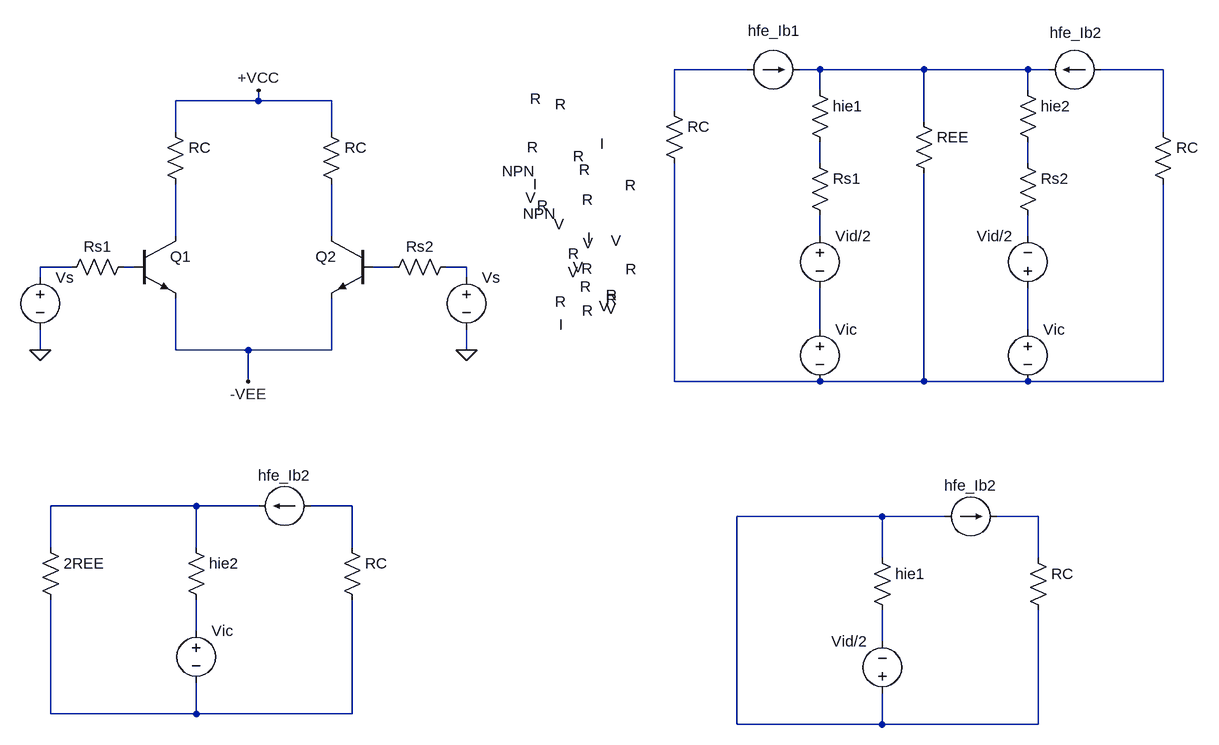
[diagram p0: schematic dibujos_primera_tanda.asc]
dibujos_primera_tanda.asc, the LTspice schematic file:
Version 4
SHEET 1 1276 824
WIRE 384 -256 272 -256
WIRE 496 -256 464 -256
WIRE 656 -256 496 -256
WIRE 816 -256 656 -256
WIRE 848 -256 816 -256
WIRE 1024 -256 928 -256
WIRE 496 -224 496 -256
WIRE 816 -224 816 -256
WIRE -368 -208 -368 -224
WIRE -368 -208 -496 -208
WIRE -256 -208 -368 -208
WIRE 272 -192 272 -256
WIRE 656 -176 656 -256
WIRE -496 -160 -496 -208
WIRE -256 -160 -256 -208
WIRE 1024 -160 1024 -256
WIRE 496 -112 496 -144
WIRE 816 -112 816 -144
WIRE -496 0 -496 -80
WIRE -256 0 -256 -80
WIRE 496 0 496 -32
WIRE 816 0 816 -32
WIRE -656 48 -704 48
WIRE -560 48 -576 48
WIRE -160 48 -192 48
WIRE -48 48 -80 48
WIRE -704 64 -704 48
WIRE -48 64 -48 48
WIRE 496 144 496 80
WIRE 816 144 816 80
WIRE -704 176 -704 144
WIRE -496 176 -496 96
WIRE -384 176 -496 176
WIRE -256 176 -256 96
WIRE -256 176 -384 176
WIRE -48 176 -48 144
WIRE -384 224 -384 176
WIRE 272 224 272 -112
WIRE 496 224 272 224
WIRE 656 224 656 -96
WIRE 656 224 496 224
WIRE 816 224 656 224
WIRE 1024 224 1024 -80
WIRE 1024 224 816 224
WIRE -464 416 -688 416
WIRE -368 416 -464 416
WIRE -224 416 -288 416
WIRE 592 432 368 432
WIRE 688 432 592 432
WIRE 832 432 768 432
WIRE -688 480 -688 416
WIRE -464 480 -464 416
WIRE -224 480 -224 416
WIRE 592 496 592 432
WIRE 832 496 832 432
WIRE -464 608 -464 560
WIRE 592 624 592 576
WIRE -688 736 -688 560
WIRE -464 736 -464 688
WIRE -464 736 -688 736
WIRE -224 736 -224 560
WIRE -224 736 -464 736
WIRE 368 752 368 432
WIRE 592 752 592 704
WIRE 592 752 368 752
WIRE 832 752 832 576
WIRE 832 752 592 752
FLAG -704 176 0
FLAG -48 176 0
FLAG -384 224 -VEE
FLAG -368 -224 +VCC
SYMBOL npn -560 0 R0
WINDOW 3 567 -100 Left 2
SYMATTR InstName Q1
SYMBOL npn -192 0 M0
WINDOW 3 -281 -34 Left 2
SYMATTR InstName Q2
SYMBOL res -512 -176 R0
WINDOW 3 562 -35 Left 2
SYMATTR InstName RC
SYMBOL res -272 -176 R0
WINDOW 3 360 -27 Left 2
SYMATTR InstName RC
SYMBOL res -560 32 R90
WINDOW 0 0 56 VBottom 2
WINDOW 3 -94 -629 VTop 2
SYMATTR InstName Rs1
SYMBOL res -64 32 R90
WINDOW 0 0 56 VBottom 2
WINDOW 3 -184 -118 VTop 2
SYMATTR InstName Rs2
SYMBOL voltage -48 48 R0
WINDOW 3 135 -66 Left 2
SYMATTR InstName Vs
SYMBOL voltage -704 48 R0
WINDOW 3 747 -107 Left 2
SYMATTR InstName Vs
SYMBOL res 256 -208 R0
WINDOW 3 -60 130 Left 2
SYMATTR InstName RC
SYMBOL current 384 -256 R270
WINDOW 0 44 42 VTop 2
WINDOW 3 -98 -223 VBottom 2
SYMATTR InstName hfe_Ib1
SYMBOL current 928 -256 R90
WINDOW 0 -41 38 VBottom 2
WINDOW 3 161 870 VTop 2
SYMATTR InstName hfe_Ib2
SYMBOL res 1008 -176 R0
WINDOW 3 -883 74 Left 2
SYMATTR InstName RC
SYMBOL res 480 -240 R0
WINDOW 3 -364 117 Left 2
SYMATTR InstName hie1
SYMBOL res 480 -128 R0
WINDOW 3 -350 72 Left 2
SYMATTR InstName Rs1
SYMBOL res 640 -192 R0
WINDOW 3 -513 270 Left 2
SYMATTR InstName REE
SYMBOL res 800 -240 R0
WINDOW 3 -603 291 Left 2
SYMATTR InstName hie2
SYMBOL res 800 -128 R0
WINDOW 3 -633 219 Left 2
SYMATTR InstName Rs2
SYMBOL voltage 496 -16 R0
WINDOW 3 -322 23 Left 2
SYMATTR InstName Vid/2
SYMBOL voltage 816 96 R180
WINDOW 0 24 96 Left 2
WINDOW 3 644 -12 Left 2
SYMATTR InstName Vid/2
SYMBOL voltage 496 128 R0
WINDOW 3 -365 -117 Left 2
SYMATTR InstName Vic
SYMBOL voltage 816 128 R0
WINDOW 3 -649 -16 Left 2
SYMATTR InstName Vic
SYMBOL res -704 464 R0
WINDOW 3 792 -363 Left 2
SYMATTR InstName 2REE
SYMBOL res -480 464 R0
WINDOW 3 610 -349 Left 2
SYMATTR InstName hie2
SYMBOL res -240 464 R0
WINDOW 3 407 -367 Left 2
SYMATTR InstName RC
SYMBOL current -288 416 R90
WINDOW 0 -32 40 VBottom 2
WINDOW 3 -429 -429 VTop 2
SYMATTR InstName hfe_Ib2
SYMBOL voltage -464 592 R0
WINDOW 3 580 -544 Left 2
SYMATTR InstName Vic
SYMBOL res 576 480 R0
WINDOW 3 -447 -430 Left 2
SYMATTR InstName hie1
SYMBOL res 816 480 R0
WINDOW 3 -708 -453 Left 2
SYMATTR InstName RC
SYMBOL current 688 432 R270
WINDOW 0 32 40 VTop 2
WINDOW 3 311 -590 VBottom 2
SYMATTR InstName hfe_Ib2
SYMBOL voltage 592 720 R180
WINDOW 0 24 96 Left 2
WINDOW 3 468 664 Left 2
SYMATTR InstName Vid/2

The netlist it stands for:
* dibujos_primera_tanda.asc
Q1 N006 N011 -VEE 0 NPN
Q2 N007 N012 -VEE 0 NPN
RC +VCC N006 R
RC +VCC N007 R
Rs1 N011 N010 R
Rs2 N013 N012 R
Vs N013 0 V
Vs N010 0 V
RC N001 N016 R
I§hfe_Ib1 N001 N002 I
I§hfe_Ib2 N003 N002 I
RC N003 N016 R
R§hie1 N002 N004 R
Rs1 N004 N008 R
REE N002 N016 R
R§hie2 N002 N005 R
Rs2 N005 N009 R
Vid/2 N008 N014 V
Vid/2 N015 N009 V
Vic N014 N016 V
Vic N015 N016 V
R§2REE N017 N023 R
R§hie2 N017 N021 R
RC N018 N023 R
I§hfe_Ib2 N018 N017 I
Vic N021 N023 V
R§hie1 N019 N022 R
RC N020 N019 R
I§hfe_Ib2 N019 N020 I
Vid/2 N019 N022 V
.model NPN NPN
.model PNP PNP
.lib standard.bjt
.backanno
.end